# Altium schematic sheet SCH_sensor.SchDoc
size A; SheetNumber: 4; SheetTotal: 4
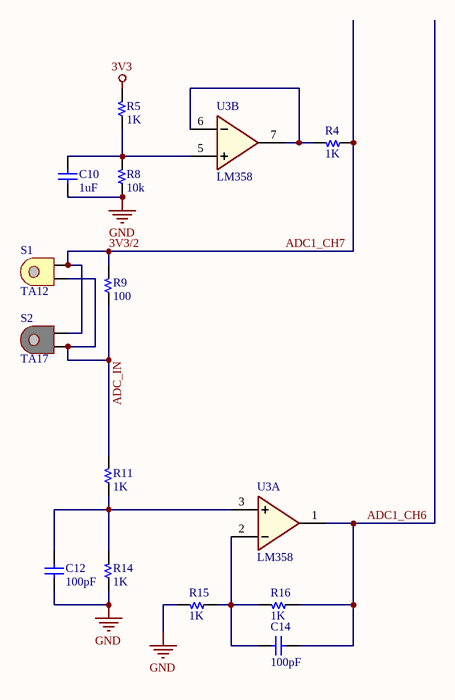
[diagram p0: SCH_sensor.SchDoc]

## Parts
C10  1uF  [C 0805]
C12  100pF  [C 0805]
C14  100pF  [C 0805]
R4  1K  [R 0805]
R5  1K  [R 0805]
R8  10k  [R 0805]
R9  100  [R 0805]
R11  1K  [R 0805]
R14  1K  [R 0805]
R15  1K  [R 0805]
R16  1K  [R 0805]
S1  TA12  [TA12]
S2  TA17  [TA17]
U3  LM358  [SOIC-8]  (parts A,B of 2)

## Nets
3V3: R5.2
GND: C10.2 C12.2 R8.1 R14.1 R15.2 U3.4(GND)
VCC: U3.8(VCC)
3V3/2: R4.1 R9.2 S1.2 S2.2  [also labelled ADC1_CH7]
ADC1_CH6: C14.2 R16.1 U3.1(OutA)
ADC_IN: R9.1 R11.2 S1.1 S2.1
NetC10_1: C10.1 R5.1 R8.2 U3.5(B+)
NetC12_1: C12.1 R11.1 R14.2 U3.3(A+)
NetC14_1: C14.1 R15.1 R16.2 U3.2(A-)
NetR4_2: R4.2 U3.6(B-) U3.7(OutB)

## Library data of the parts
C10 C12 C14 = Capacitor NP: Capacitor non-pol
R4 R5 R8 R9 R11 R14-R16 = Resistor
U3 = LM358: Low Power Dual Operational Amplifiers